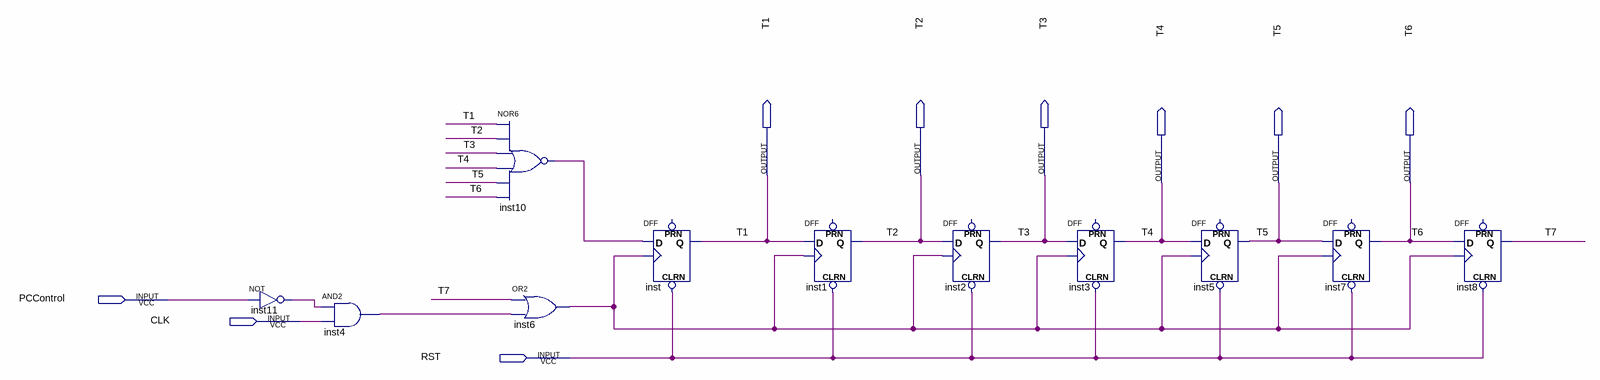
[diagram p0: schematic sheet]
// Quartus schematic Stmp.bdf as structural Verilog: 11 symbols, 9 pins
module Stmp (
  input  PCControl,
  input  CLK,
  input  RST,
  output T1,
  output T2,
  output T3,
  output T4,
  output T5,
  output T6
);

  wire inst4_out, inst6_out, inst10_out, inst11_out, T7;

  not inst11 (inst11_out, PCControl);
  and inst4 (inst4_out, inst11_out, CLK);
  nor inst10 (inst10_out, T1, T2, T3, T4, T5, T6);
  or inst6 (inst6_out, T7, inst4_out);
  DFF inst (.CLRN(RST), .CLK(inst6_out), .D(inst10_out), .Q(T1));  // open: PRN
  DFF inst1 (.CLRN(RST), .CLK(inst6_out), .D(T1), .Q(T2));  // open: PRN
  DFF inst2 (.CLRN(RST), .CLK(inst6_out), .D(T2), .Q(T3));  // open: PRN
  DFF inst3 (.CLRN(RST), .CLK(inst6_out), .D(T3), .Q(T4));  // open: PRN
  DFF inst5 (.CLRN(RST), .CLK(inst6_out), .D(T4), .Q(T5));  // open: PRN
  DFF inst7 (.CLRN(RST), .CLK(inst6_out), .D(T5), .Q(T6));  // open: PRN
  DFF inst8 (.CLRN(RST), .CLK(inst6_out), .D(T6), .Q(T7));  // open: PRN
endmodule
